# Altium schematic sheet MIXR Processing - STM32 DSP Misc.SchDoc: STM32F767 DSP Microcontroller - Clock & Power
size B; Organization: Midnight Sun Solar Rayce Car Team; Address1: University of Waterloo; Address2: 200 University Ave W; Address3: Waterloo, ON, Canada; Address4: N2L 3E9; DocumentNumber: 10; SheetNumber: 10; SheetTotal: 14; Website: www.uwmidsun.com; ProjectName: ProjectName
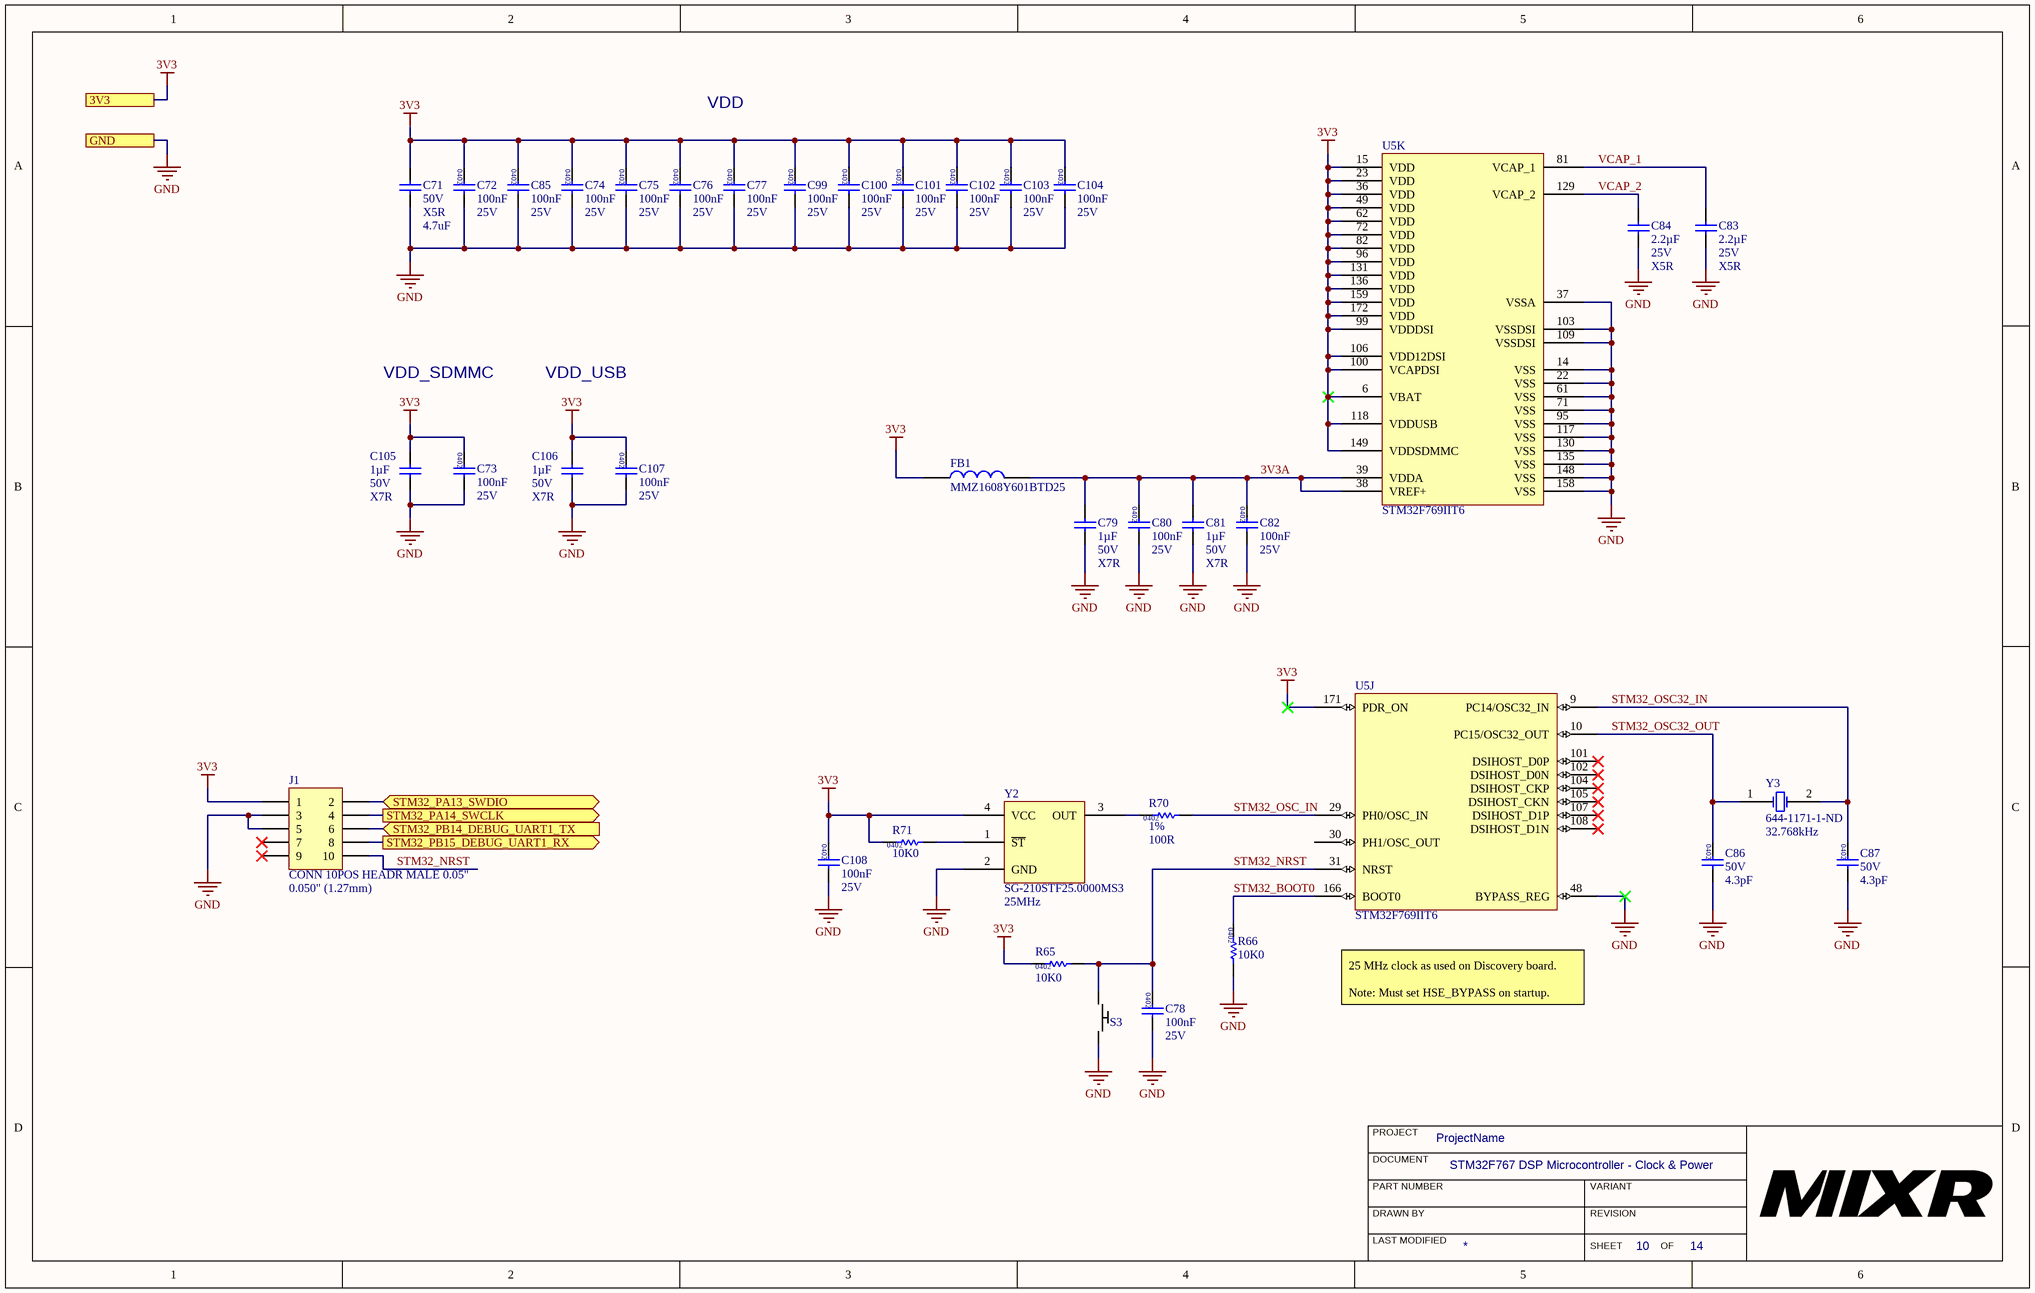
[diagram p0: MIXR Processing - STM32 DSP Misc.SchDoc]

## Parts
C71  value 4.7uF  Voltage - Rated: 50V  Temperature Coefficient: X5R  [CAP, 0805]  (hidden comment: CAP CER 4.7UF 50V 10% X5R 0805)
C72  Capacitance: 100nF  Voltage: 25V  [CAP 0402]  (hidden comment: CAP CER 0.1UF 16V X7R 0402)
C73  Capacitance: 100nF  Voltage: 25V  [CAP 0402]  (hidden comment: CAP CER 0.1UF 16V X7R 0402)
C74  Capacitance: 100nF  Voltage: 25V  [CAP 0402]  (hidden comment: CAP CER 0.1UF 16V X7R 0402)
C75  Capacitance: 100nF  Voltage: 25V  [CAP 0402]  (hidden comment: CAP CER 0.1UF 16V X7R 0402)
C76  Capacitance: 100nF  Voltage: 25V  [CAP 0402]  (hidden comment: CAP CER 0.1UF 16V X7R 0402)
C77  Capacitance: 100nF  Voltage: 25V  [CAP 0402]  (hidden comment: CAP CER 0.1UF 16V X7R 0402)
C78  Capacitance: 100nF  Voltage: 25V  [CAP 0402]  (hidden comment: CAP CER 0.1UF 16V X7R 0402)
C79  Capacitance: 1µF  Voltage: 50V  Temperature Coefficient: X7R  [CAP, 0603]  (hidden comment: CAP CER 1UF 50V 10% X7R 0603)
C80  Capacitance: 100nF  Voltage: 25V  [CAP 0402]  (hidden comment: CAP CER 0.1UF 16V X7R 0402)
C81  Capacitance: 1µF  Voltage: 50V  Temperature Coefficient: X7R  [CAP, 0603]  (hidden comment: CAP CER 1UF 50V 10% X7R 0603)
C82  Capacitance: 100nF  Voltage: 25V  [CAP 0402]  (hidden comment: CAP CER 0.1UF 16V X7R 0402)
C83  Capacitance: 2.2µF  Voltage: 25V  Temperature Coefficient: X5R  [CAP, 0603]  (hidden comment: CAP CER 2.2UF 25V 10% X5R 0603)
C84  Capacitance: 2.2µF  Voltage: 25V  Temperature Coefficient: X5R  [CAP, 0603]  (hidden comment: CAP CER 2.2UF 25V 10% X5R 0603)
C85  Capacitance: 100nF  Voltage: 25V  [CAP 0402]  (hidden comment: CAP CER 0.1UF 16V X7R 0402)
C86  Voltage Rating: 50V  Capacitance: 4.3pF  [CAP 0402]  (hidden comment: CAP CER 4.3PF 50V C0G/NPO 0402)
C87  Voltage Rating: 50V  Capacitance: 4.3pF  [CAP 0402]  (hidden comment: CAP CER 4.3PF 50V C0G/NPO 0402)
C99  Capacitance: 100nF  Voltage: 25V  [CAP 0402]  (hidden comment: CAP CER 0.1UF 16V X7R 0402)
C100  Capacitance: 100nF  Voltage: 25V  [CAP 0402]  (hidden comment: CAP CER 0.1UF 16V X7R 0402)
C101  Capacitance: 100nF  Voltage: 25V  [CAP 0402]  (hidden comment: CAP CER 0.1UF 16V X7R 0402)
C102  Capacitance: 100nF  Voltage: 25V  [CAP 0402]  (hidden comment: CAP CER 0.1UF 16V X7R 0402)
C103  Capacitance: 100nF  Voltage: 25V  [CAP 0402]  (hidden comment: CAP CER 0.1UF 16V X7R 0402)
C104  Capacitance: 100nF  Voltage: 25V  [CAP 0402]  (hidden comment: CAP CER 0.1UF 16V X7R 0402)
C105  Capacitance: 1µF  Voltage: 50V  Temperature Coefficient: X7R  [CAP, 0603]  (hidden comment: CAP CER 1UF 50V 10% X7R 0603)
C106  Capacitance: 1µF  Voltage: 50V  Temperature Coefficient: X7R  [CAP, 0603]  (hidden comment: CAP CER 1UF 50V 10% X7R 0603)
C107  Capacitance: 100nF  Voltage: 25V  [CAP 0402]  (hidden comment: CAP CER 0.1UF 16V X7R 0402)
C108  Capacitance: 100nF  Voltage: 25V  [CAP 0402]  (hidden comment: CAP CER 0.1UF 16V X7R 0402)
FB1  Manufacturer Part Number: MMZ1608Y601BTD25  [FB 0603]  (hidden comment: FB 600 OHM 1LN 0603)
J1  CONN 10POS HEADR MALE 0.05"  Pitch - Mating: 0.050" (1.27mm)  [CONN, 10POS 0.05" Debug Header]
R65  Resistance: 10K0  [RES 0402]  (hidden comment: RES 10K OHM 1% 1/16W 0402)
R66  Resistance: 10K0  [RES 0402]  (hidden comment: RES 10K OHM 1% 1/16W 0402)
R70  Tolerance: 1%  Resistance: 100R  [RES 0402]  (hidden comment: RES 100 OHM 1% 1/16W 0402)
R71  Resistance: 10K0  [RES 0402]  (hidden comment: RES 10K OHM 1% 1/16W 0402)
S3  SPST  [SW SPST-NO 0.05A 12V]  (value not drawn)
U5  Manufacturer Part Number: STM32F769IIT6  [TSQFP50P2600X2600X160-176M]  (hidden comment: IC MCU STM32F769II 176-LQFP)  (parts J,K of 11)
Y2  Manufacturer Part Number: SG-210STF25.0000MS3  Frequency: 25MHz  [CRYSTAL 25 MHz OSC XO CMOS SMD]  (hidden comment: CRYSTAL 25 MHz OSC XO CMOS SMD)
Y3  Supplier Part Number 1: 644-1171-1-ND  Frequency: 32.768kHz  [CRYSTAL 32.7680 KHZ 6PF 2-SMD]  (hidden comment: CRYSTAL 32.7680 KHZ 6PF 2-SMD)

## Ports
3V3, GND, STM32_PA13_SWDIO (bidir), STM32_PA14_SWCLK (out), STM32_PB14_DEBUG_UART1_TX (in), STM32_PB15_DEBUG_UART1_RX (out)

## Nets
3V3: C71.1 C72.1 C73.1 C74.1 C75.1 C76.1 C77.1 C85.1 C99.1 C100.1 C101.1 C102.1 C103.1 C104.1 C105.1 C106.1 C107.1 C108.1 FB1.1 J1.1 R65.1 R71.1 U5.6(VBAT) U5.15(VDD) U5.23(VDD) U5.36(VDD) U5.49(VDD) U5.62(VDD) U5.72(VDD) U5.82(VDD) U5.96(VDD) U5.99(VDDDSI) U5.100(VCAPDSI) U5.106(VDD12DSI) U5.118(VDDUSB) U5.131(VDD) U5.136(VDD) U5.149(VDDSDMMC) U5.159(VDD) U5.171(PDR_ON) U5.172(VDD) Y2.4(VCC) ; port 3V3
GND: C71.2 C72.2 C73.2 C74.2 C75.2 C76.2 C77.2 C78.2 C79.2 C80.2 C81.2 C82.2 C83.2 C84.2 C85.2 C86.2 C87.2 C99.2 C100.2 C101.2 C102.2 C103.2 C104.2 C105.2 C106.2 C107.2 C108.2 J1.3 J1.5 R66.2 S3.2 U5.14(VSS) U5.22(VSS) U5.37(VSSA) U5.48(BYPASS_REG) U5.61(VSS) U5.71(VSS) U5.95(VSS) U5.103(VSSDSI) U5.109(VSSDSI) U5.117(VSS) U5.130(VSS) U5.135(VSS) U5.148(VSS) U5.158(VSS) Y2.2(GND) ; port GND
3V3A: C79.1 C80.1 C81.1 C82.1 FB1.2 U5.38(VREF+) U5.39(VDDA)
STM32_BOOT0: R66.1 U5.166(BOOT0)
STM32_NRST: C78.1 J1.10 R65.2 S3.1 U5.31(NRST)
STM32_OSC32_IN: C87.1 U5.9(PC14/OSC32_IN) Y3.2
STM32_OSC32_OUT: C86.1 U5.10(PC15/OSC32_OUT) Y3.1
STM32_OSC_IN: R70.2 U5.29(PH0/OSC_IN)
STM32_PA13_SWDIO: J1.2 ; port STM32_PA13_SWDIO
STM32_PA14_SWCLK: J1.4 ; port STM32_PA14_SWCLK
STM32_PB14_DEBUG_UART1_TX: J1.6 ; port STM32_PB14_DEBUG_UART1_TX
STM32_PB15_DEBUG_UART1_RX: J1.8 ; port STM32_PB15_DEBUG_UART1_RX
VCAP_1: C83.1 U5.81(VCAP_1)
VCAP_2: C84.1 U5.129(VCAP_2)
NetR70_1: R70.1 Y2.3(OUT)
NetR71_2: R71.2 Y2.1(~{ST})

Not connected (* = marked no-connect by the designer): J1 7* 9*; U5 30(PH1/OSC_OUT) 101(DSIHOST_D0P)* 102(DSIHOST_D0N)* 104(DSIHOST_CKP)* 105(DSIHOST_CKN)* 107(DSIHOST_D1P)* 108(DSIHOST_D1N)*

## Notes on the sheet
- VDD
- VDD_SDMMC
- VDD_USB
- 25 MHz clock as used on Discovery board.
  Note: Must set HSE_BYPASS on startup.
- PROJECT
- DOCUMENT
- DRAWN BY
- LAST MODIFIED
- PART NUMBER
- REVISION
- SHEET
- VARIANT
- OF

## Library data of the parts
C71 = CAP CER 4.7UF 50V 10% X5R 0805: 4.7µF ±20% 50V Ceramic Capacitor X5R 0805 (2012 Metric); Manufacturer 1: Murata Electronics North America; Manufacturer Part Number 1: GRT21BR61H475ME13L; Description 1: CAP CER 4.7UF 50V X5R 0805; Supplier 1: Digi-Key; Supplier Part Number 1: 490-12395-1-ND; RoHS: RoHS Compliant; Category: Capacitors; Stock 1: 4286; Pricing 1: 1=0.56, 10=0.389, 100=0.2338, 500=0.17536, 1000=0.14808 (CAD); Packaging: Cut Tape (CT); Part Status: Active; Tolerance: ±20%; Operating Temperature: -55°C ~ 85°C; Features: -; Ratings: AEC-Q200; Applications: Automotive; Mounting Type: Surface Mount, MLCC; Package / Case: 0805 (2012 Metric); Size / Dimension: 0.079" L x 0.049" W (2.00mm x 1.25mm); Height - Seated (Max): -; Thickness (Max): 0.057" (1.45mm); Lead Spacing: -; Lead Style: -; ComponentLink1URL: http://search.murata.co.jp/Ceramy/image/img/A01X/G101/ENG/GRT21BR61H475ME13-01.pdf; ComponentLink1Description: http://search.murata.co.jp/Ceramy/image/img/A01X/G101/ENG/GRT21BR61H475ME13-01.pdf
C72-C78 C80 C82 C85 C99-C104 C107 C108 = CAP CER 0.1UF 16V X7R 0402: Cap Ceramic 0.1uF 25V X7R 10% SMD 0402 125C Paper T/R; Manufacturer: Murata; Manufacturer Part Number: GRM155R71E104KE14D; Supplier 1: Digi-Key; Supplier Part Number 1: 490-10698-1-ND; Packaging: Tape and Reel; ComponentLink1URL: http://www.farnell.com/datasheets/2048008.pdf?src-supplier=Farnell; ComponentLink1Description: http://www.farnell.com/datasheets/2048008.pdf?src-supplier=Farnell; Tolerance: 10%; RoHS: Yes; Category: Ceramic Capacitors; Stock 1: 785540; Pricing 1: 1=0.10000, 10=0.03400, 100=0.01520, 500=0.01088, 1000=0.00855, 2500=0.00778, 5000=0.00715 (USD); Mount: Surface Mount; Case/Package: 0402; Weight: 0.000212oz; Case Code (Metric): 1005; Case Code (Imperial): 0402; Dielectric Material: Ceramic; Min Operating Temperature: -55°C; Max Operating Temperature: 125°C; Termination: SMD/SMT; Composition: Ceramic; Package Quantity: 10000; Length: 1mm; Height: 0.5mm; Width: 0.02inch; Thickness: 0.022inch; Depth: 0.5mm; REACH SVHC: Unknown; Lead Free: Lead Free; ComponentLink2URL: http://uk.rs-online.com/webdocs/144c/0900766b8144c113.pdf?src-supplier=RSComponents; ComponentLink2Description: http://uk.rs-online.com/webdocs/144c/0900766b8144c113.pdf?src-supplier=RSComponents; ComponentLink3URL: http://www.farnell.com/datasheets/1872206.pdf?src-supplier=Farnell; ComponentLink3Description: http://www.farnell.com/datasheets/1872206.pdf?src-supplier=Farnell; ComponentLink4URL: http://components.arrow.com/part/dataview/0323_06361249?src-supplier=Arrow+Europe; ComponentLink4Description: http://components.arrow.com/part/dataview/0323_06361249?src-supplier=Arrow+Europe; ComponentLink5URL: http://www.mouser.com/ds/2/281/c02e-2905.pdf?src-supplier=Mouser; ComponentLink5Description: http://www.mouser.com/ds/2/281/c02e-2905.pdf?src-supplier=Mouser; ComponentLink6URL: http://www.farnell.com/datasheets/2048008.pdf?src-supplier=Newark; ComponentLink6Description: http://www.farnell.com/datasheets/2048008.pdf?src-supplier=Newark; ComponentLink7URL: http://psearch.en.murata.com/capacitor/product/GRM155R71E104KE14%23.pdf?src-supplier=Avnet; ComponentLink7Description: http://psearch.en.murata.com/capacitor/product/GRM155R71E104KE14%23.pdf?src-supplier=Avnet; ComponentLink8URL: https://search.murata.co.jp/Ceramy/image/img/A01X/G101/ENG/GRM155R71E104KE14-01.pdf?src-supplier=Digi-Key; ComponentLink8Description: https://search.murata.co.jp/Ceramy/image/img/A01X/G101/ENG/GRM155R71E104KE14-01.pdf?src-supplier=Digi-Key; ComponentLink9URL: http://www.farnell.com/datasheets/2048008.pdf?src-supplier=Element14; ComponentLink9Description: http://www.farnell.com/datasheets/2048008.pdf?src-supplier=Element14; Dielectric: X7R; Voltage Rating (DC): 25V; Voltage Rating: 25V
C79 C81 C105 C106 = CAP CER 1UF 50V 10% X7R 0603: 1µF ±10% 50V Ceramic Capacitor X7R 0603 (1608 Metric); Manufacturer 1: Taiyo Yuden; Manufacturer Part Number 1: UMK107AB7105KA-T; Supplier 1: Digi-Key; Supplier Part Number 1: 587-3247-1-ND; Packaging: Cut Tape (CT); Part Status: Active; Operating Temperature: -55°C ~ 125°C; Ratings: -; Mounting Type: Surface Mount, MLCC; Package / Case: 0603 (1608 Metric); Size / Dimension: 0.063" L x 0.031" W (1.60mm x 0.80mm); Height - Seated (Max): -; Thickness (Max): 0.037" (0.95mm); Lead Spacing: -; Lead Style: -; ComponentLink1URL: http://www.yuden.co.jp/productdata/catalog/en/mlcc_all_e.pdf; ComponentLink1Description: http://www.yuden.co.jp/productdata/catalog/en/mlcc_all_e.pdf; Tolerance: ±10%
C83 C84 = CAP CER 2.2UF 25V 10% X5R 0603: 2.2µF ±10% 25V Ceramic Capacitor X5R 0603 (1608 Metric); Manufacturer 1: Murata Electronics North America; Manufacturer Part Number 1: GRM188R61E225KA12D; Supplier 1: Digi-Key; Supplier Part Number 1: 490-10731-1-ND; Packaging: Cut Tape (CT); Part Status: Active; Operating Temperature: -55°C ~ 85°C; Ratings: -; Mounting Type: Surface Mount, MLCC; Package / Case: 0603 (1608 Metric); Size / Dimension: 0.063" L x 0.031" W (1.60mm x 0.80mm); Height - Seated (Max): -; Thickness (Max): 0.035" (0.90mm); Lead Spacing: -; Lead Style: -; ComponentLink1URL: http://www.murata.com/~/media/webrenewal/support/library/catalog/products/capacitor/mlcc/c02e.ashx; ComponentLink1Description: http://www.murata.com/~/media/webrenewal/support/library/catalog/products/capacitor/mlcc/c02e.ashx; Tolerance: ±10%
C86 C87 = CAP CER 4.3PF 50V C0G/NPO 0402: Multilayer Ceramic Capacitors MLCC - SMD/SMT 0402 4.3pF 50Volts C0G +/-0.1pF; Manufacturer: Murata; Manufacturer Part Number: GJM1555C1H4R3BB01D; Supplier 1: Digi-Key; RoHS: Yes; Category: Ceramic Capacitors; Stock 1: 18899; Pricing 1: 1=0.19000, 10=0.13000, 100=0.06590, 500=0.04508, 1000=0.03987, 2500=0.03814, 5000=0.03467 (USD); Mount: Surface Mount; Case/Package: 0402; Case Code (Metric): 1005; Case Code (Imperial): 0402; Min Operating Temperature: -55°C; Max Operating Temperature: 125°C; Package Quantity: 10000; Packaging: Tape and Reel; Dielectric: C0G; Voltage Rating (DC): 50V; Termination: SMD/SMT; Length: 1mm; Height: 0.5mm; Width: 0.02inch; Thickness: 0.022inch; Depth: 0.5mm; Radiation Hardening: No; ComponentLink1URL: https://datasheet.ciiva.com/11613/product-11613476.pdf?src-supplier=Avnet; ComponentLink1Description: https://datasheet.ciiva.com/11613/product-11613476.pdf?src-supplier=Avnet; ComponentLink2URL: https://datasheet.ciiva.com/29536/partnumbering-e-01-29536085.pdf?src-supplier=Digi-Key; ComponentLink2Description: https://datasheet.ciiva.com/29536/partnumbering-e-01-29536085.pdf?src-supplier=Digi-Key; ComponentLink3URL: https://datasheet.ciiva.com/29536/partnumbering-e-01-29536086.pdf?src-supplier=Digi-Key; ComponentLink3Description: https://datasheet.ciiva.com/29536/partnumbering-e-01-29536086.pdf?src-supplier=Digi-Key; Supplier Part Number 1: 490-8582-1-ND
FB1 = FB 600 OHM 1LN 0603: FERRITE BEAD 600 OHM 0603 1LN; Manufacturer: TDK; Number of Lines: 1; Max Current Rating: 500mA; DC Resistance (DCR): 400mR; Impedance: 600R; Tolerance: 25%; Test Frequency: 100MHz; Supplier 1: Digi-Key; Supplier Part Number 1: 445-172850-1-ND; RoHS: Yes; Stock 1: 19540; Pricing 1: 1 = 0.10000, 10 = 0.07600, 25 = 0.06840, 50 = 0.05000, 100 = 0.04330, 250 = 0.03416, 500 = 0.02884, 1000 = 0.02429 (USD); Mount: Surface Mount; Case/Package: 0603; Weight: 7.1E-05oz; Case Code (Metric): 1608; Case Code (Imperial): 0603; Min Operating Temperature: -55°C; Max Operating Temperature: 125°C; Package Quantity: 4000; Packaging: Tape and Reel; Termination: SMD/SMT; Max DC Current: 500mA; Length: 0.063inch; Height: 0.037inch; Width: 0.031inch; Ratings: AEC-Q200
J1 = CONN 10POS HEADR MALE 0.05": 10 Positions Header Connector 0.050" (1.27mm) Surface Mount Gold; Manufacturer 1: Amphenol FCI; Manufacturer Part Number 1: 20021121-00010C4LF; Style: Board to Board; Shrouding: Unshrouded; Number of Positions: 10; Number of Positions Loaded: All; Contact Length - Mating: 0.120" (3.05mm); Material Flammability Rating: UL94 V-0; Supplier 1: Digi-Key; Supplier Part Number 1: 609-3695-1-ND; Packaging: Cut Tape (CT); Part Status: Active; Connector Type: Header; Contact Type: Male Pin; Number of Rows: 2; Row Spacing - Mating: 0.050" (1.27mm); Mounting Type: Surface Mount; Termination: Solder; Fastening Type: -; Contact Length - Post: -; Overall Contact Length: -; Insulation Height: -; Contact Shape: Square; Contact Finish - Mating: Gold; Contact Finish Thickness - Mating: 10µin (0.25µm); Contact Finish - Post: Tin; Contact Material: Copper Alloy; Insulation Material: Thermoplastic; Operating Temperature: -; Ingress Protection: -; Insulation Color: Black; Current Rating: -; Mated Stacking Heights: -; Contact Finish Thickness - Post: 50µin (1.27µm); ComponentLink1URL: http://portal.fciconnect.com/Comergent//fci/drawing/20021121.pdf; ComponentLink1Description: http://portal.fciconnect.com/Comergent//fci/drawing/20021121.pdf; Voltage: -
R65 R66 R71 = RES 10K OHM 1% 1/16W 0402: Surface Mount Thick Film Resistor, Rc Series, 10 Kohm, 62.5 Mw, - 1%, 50 V, 0402 [1005 Metric]; Manufacturer: Yageo; Manufacturer Part Number: RC0402FR-0710KL; Temperature Coefficient: 100ppm/°C; Voltage Rating: 50V; Power Rating: 62.5mW; Supplier 1: Digi-Key; Supplier Part Number 1: 311-10.0KLRCT-ND; Packaging: Tape and Reel; Composition: Thick Film; ComponentLink1URL: https://datasheet.ciiva.com/7660/38568-7660787.pdf?src-supplier=Element14; ComponentLink1Description: https://datasheet.ciiva.com/7660/38568-7660787.pdf?src-supplier=Element14; Tolerance: 1%; RoHS: Yes; Category: Chip SMD Resistors; Stock 1: 60761136; Pricing 1: 1=0.10000, 10=0.01600, 100=0.00640, 1000=0.00289, 2500=0.00251, 5000=0.00207 (USD); Case/Package: 0402; Number of Pins: 2; Case Code (Imperial): 0402; Case Code (Metric): 1005; Min Operating Temperature: -55°C; Max Operating Temperature: 155°C; Voltage Rating (DC): 50V; Termination: SMD/SMT; Military Standard: Not; Working Voltage: 50V; Number of Terminations: 2; Length: 1mm; Height: 0.32mm; Width: 0.5mm; Depth: 0.5mm; Lead Pitch: 0.2mm; REACH SVHC: No SVHC; Lead Free: Lead Free; ComponentLink2URL: https://datasheet.ciiva.com/7983/1018594-7983486.pdf?src-supplier=Element14; ComponentLink2Description: https://datasheet.ciiva.com/7983/1018594-7983486.pdf?src-supplier=Element14; ComponentLink3URL: https://datasheet.ciiva.com/7849/1784430-7849813.pdf?src-supplier=Element14; ComponentLink3Description: https://datasheet.ciiva.com/7849/1784430-7849813.pdf?src-supplier=Element14; ComponentLink4URL: https://datasheet.ciiva.com/7849/1686128-7849814.pdf?src-supplier=Element14; ComponentLink4Description: https://datasheet.ciiva.com/7849/1686128-7849814.pdf?src-supplier=Element14; ComponentLink5URL: https://datasheet.ciiva.com/7849/1784430-7849815.pdf?src-supplier=Element14; ComponentLink5Description: https://datasheet.ciiva.com/7849/1784430-7849815.pdf?src-supplier=Element14; ComponentLink6URL: https://datasheet.ciiva.com/22747/1018594-22747512.pdf?src-supplier=Element14; ComponentLink6Description: https://datasheet.ciiva.com/22747/1018594-22747512.pdf?src-supplier=Element14; ComponentLink7URL: https://datasheet.ciiva.com/12667/pyu-rc0402-51-rohs-l-6-r-12667067.pdf?src-supplier=Mouser; ComponentLink7Description: https://datasheet.ciiva.com/12667/pyu-rc0402-51-rohs-l-6-r-12667067.pdf?src-supplier=Mouser
R70 = RES 100 OHM 1% 1/16W 0402: 100 Ohms ±1% 0.063W, 1/16W Chip Resistor 0402 (1005 Metric) Moisture Resistant Thick Film; Manufacturer: Yageo; Manufacturer Part Number: RC0402FR-07100RL; Power Rating: 62.5mW; Voltage Rating: 50V; Temperature Coefficient: 100ppm/°C; Supplier 1: Digi-Key; RoHS: Yes; Category: Chip SMD Resistors; Stock 1: 42351567; Pricing 1: 1=0.10000, 10=0.01600, 100=0.00640, 1000=0.00289, 2500=0.00251, 5000=0.00207 (USD); Case/Package: 0402; Number of Pins: 2; Case Code (Imperial): 0402; Case Code (Metric): 1005; Min Operating Temperature: -55°C; Max Operating Temperature: 155°C; Packaging: Tape and Reel; Termination: SMD/SMT; Composition: Thick Film; Military Standard: Not; Voltage Rating (DC): 50V; Length: 1mm; Height: 0.32mm; Depth: 0.5mm; Width: 0.5mm; REACH SVHC: No SVHC; Lead Free: Lead Free; ComponentLink1URL: https://datasheet.ciiva.com/7849/1784430-7849810.pdf?src-supplier=Element14; ComponentLink1Description: https://datasheet.ciiva.com/7849/1784430-7849810.pdf?src-supplier=Element14; ComponentLink2URL: https://datasheet.ciiva.com/11808/0900766b80c66297-11808765.pdf?src-supplier=RSComponents; ComponentLink2Description: https://datasheet.ciiva.com/11808/0900766b80c66297-11808765.pdf?src-supplier=RSComponents; ComponentLink3URL: https://datasheet.ciiva.com/22747/1018594-22747511.pdf?src-supplier=Element14; ComponentLink3Description: https://datasheet.ciiva.com/22747/1018594-22747511.pdf?src-supplier=Element14; ComponentLink4URL: https://datasheet.ciiva.com/12667/pyu-rc0402-51-rohs-l-6-r-12667957.pdf?src-supplier=Mouser; ComponentLink4Description: https://datasheet.ciiva.com/12667/pyu-rc0402-51-rohs-l-6-r-12667957.pdf?src-supplier=Mouser; ComponentLink5URL: https://datasheet.ciiva.com/16740/pyu-rc0402-51-rohs-l-6-r-16740566.pdf?src-supplier=Future+Electronics; ComponentLink5Description: https://datasheet.ciiva.com/16740/pyu-rc0402-51-rohs-l-6-r-16740566.pdf?src-supplier=Future+Electronics; ComponentLink6URL: https://datasheet.ciiva.com/15189/getdatasheetpartid-329466-15189335.pdf?src-supplier=Verical; ComponentLink6Description: https://datasheet.ciiva.com/15189/getdatasheetpartid-329466-15189335.pdf?src-supplier=Verical; ComponentLink7URL: https://datasheet.ciiva.com/28367/1018594-28367226.pdf?src-supplier=Element14; ComponentLink7Description: https://datasheet.ciiva.com/28367/1018594-28367226.pdf?src-supplier=Element14; Supplier Part Number 1: 311-100LRCT-ND
S3 = SW SPST-NO 0.05A 12V: SWITCH TACTILE SPST-NO 50MA 12V; Manufacturer: E-Switch; Manufacturer Part Number: TL3305AF260QG; Mechanical Life: 200000Cycles; Illumination Type: Non-Illuminated; Operating Force: 260gf; Switch Travel: 0.2mm; Switch Function: Off-Mom; Actuator Type: Standard; Supplier 1: Digi-Key; RoHS: Yes; Category: Tactile Switches; Stock 1: 10795; Pricing 1: 1=0.20000, 10=0.19500, 25=0.18800, 50=0.18120, 100=0.17110, 250=0.16104, 500=0.15434, 1000=0.11743 (USD); Mount: Surface Mount; Min Operating Temperature: -20°C; Max Operating Temperature: 70°C; Packaging: Tape and Reel; Termination: Gull Wing; Throw Configuration: SPST; Lead Free: Lead Free; ComponentLink1URL: http://www.farnell.com/datasheets/2554191.pdf?src-supplier=Farnell; ComponentLink1Description: http://www.farnell.com/datasheets/2554191.pdf?src-supplier=Farnell; ComponentLink2URL: http://spec_sheets.e-switch.com/specs/P010471.pdf?src-supplier=Newark; ComponentLink2Description: http://spec_sheets.e-switch.com/specs/P010471.pdf?src-supplier=Newark; ComponentLink3URL: http://spec_sheets.e-switch.com/specs/P010471.pdf?src-supplier=Future+Electronics; ComponentLink3Description: http://spec_sheets.e-switch.com/specs/P010471.pdf?src-supplier=Future+Electronics; ComponentLink4URL: http://spec_sheets.e-switch.com/specs/P010471.pdf?src-supplier=Digi-Key; ComponentLink4Description: http://spec_sheets.e-switch.com/specs/P010471.pdf?src-supplier=Digi-Key; ComponentLink5URL: http://spec_sheets.e-switch.com/specs/P010471.pdf?src-supplier=Mouser; ComponentLink5Description: http://spec_sheets.e-switch.com/specs/P010471.pdf?src-supplier=Mouser; ComponentLink6URL: http://spec_sheets.e-switch.com/specs/P010471.pdf?src-supplier=NAC+Semi; ComponentLink6Description: http://spec_sheets.e-switch.com/specs/P010471.pdf?src-supplier=NAC+Semi; Supplier Part Number 1: EG5353CT-ND
U5 = IC MCU STM32F769II 176-LQFP: ARM® Cortex®-M7 STM32F7 Microcontroller IC 32-Bit 216MHz 2MB (2M x 8) FLASH 176-LQFP (24x24); Manufacturer: STMicroelectronics; Supplier 1: Digi-Key; RoHS: No; Category: Microcontrollers; Stock 1: 295; Pricing 1: 1=12.69000, 10=11.66300, 25=11.18000, 100=9.85040, 250=9.36696, 500=8.76264, 1000=8.03746 (USD); ComponentLink1URL: http://www.st.com/content/ccc/resource/technical/document/errata_sheet/group0/23/a6/11/0b/30/24/46/a5/DM00257543/files/DM00257543.pdf/jcr:content/translations/en.DM00257543.pdf?src-supplier=Digi-Key; ComponentLink1Description: http://www.st.com/content/ccc/resource/technical/document/errata_sheet/group0/23/a6/11/0b/30/24/46/a5/DM00257543/files/DM00257543.pdf/jcr:content/translations/en.DM00257543.pdf?src-supplier=Digi-Key; Supplier Part Number 1: 497-16649-ND
Y2 = CRYSTAL 25 MHz OSC XO CMOS SMD: XTAL OSC XO 25.0000MHZ CMOS SMD; Manufacturer: Epson; Max Supply Current: 2.2mA; Frequency Stability: 25ppm; Load Capacitance: 15pF; Min Supply Voltage: 1.6V; Max Supply Voltage: 3.6V; Max Duty Cycle: 55%; Supplier 1: Digi-Key; RoHS: Yes; Category: Oscillators; Stock 1: 1693; Pricing 1: 1=1.21000, 10=1.15900, 50=1.13200, 100=0.97020 (USD); Mount: Surface Mount; Case/Package: SMD/SMT; Min Operating Temperature: -20°C; Max Operating Temperature: 70°C; Package Quantity: 250; Packaging: Tape and Reel; Termination: SMD/SMT; Current Rating: 2.2mA; Length: 0.098inch; Height: 0.035inch; Width: 0.079inch; Lead Free: Lead Free; ComponentLink1URL: https://datasheet.ciiva.com/29629/029-sg-210stf-e147-29629845.pdf?src-supplier=Digi-Key; ComponentLink1Description: https://datasheet.ciiva.com/29629/029-sg-210stf-e147-29629845.pdf?src-supplier=Digi-Key; ComponentLink2URL: https://datasheet.ciiva.com/29629/029-sg-210stf-e147-29629799.pdf?src-supplier=Digi-Key; ComponentLink2Description: https://datasheet.ciiva.com/29629/029-sg-210stf-e147-29629799.pdf?src-supplier=Digi-Key; ComponentLink3URL: https://datasheet.ciiva.com/29629/029-sg-210stf-e147-29629798.pdf?src-supplier=Digi-Key; ComponentLink3Description: https://datasheet.ciiva.com/29629/029-sg-210stf-e147-29629798.pdf?src-supplier=Digi-Key; Supplier Part Number 1: SER3804CT-ND
Y3 = CRYSTAL 32.7680 KHZ 6PF 2-SMD: Crystal 32.7680KHZ 6PF SMD; Manufacturer: NDK; Manufacturer Part Number: NX3215SA-32.768K-STD-MUA-14; Frequency Tolerance: 20ppm; ESR (Equivalent Series Resistance): 70kR; Supplier 1: Digi-Key; RoHS: Yes; Category: Crystals; Stock 1: 61958; Pricing 1: 1=0.68000, 10=0.60200, 50=0.56280, 100=0.49740, 500=0.47124, 1000=0.39270 (USD); Mount: Surface Mount; Case/Package: SMD/SMT; Number of Pins: 2; Min Operating Temperature: -40°C; Max Operating Temperature: 85°C; Packaging: Tape and Reel; Package Quantity: 3000; Length: 0.126inch; Height: 0.035inch; Width: 0.059inch; ComponentLink1URL: https://datasheet.ciiva.com/6733/c-nx3215sa-std-mua-9-e-6733110.pdf?src-supplier=Digi-Key; ComponentLink1Description: https://datasheet.ciiva.com/6733/c-nx3215sa-std-mua-9-e-6733110.pdf?src-supplier=Digi-Key; ComponentLink2URL: https://datasheet.ciiva.com/6733/c-nx3215sa-std-mua-9-e-6733111.pdf?src-supplier=Digi-Key; ComponentLink2Description: https://datasheet.ciiva.com/6733/c-nx3215sa-std-mua-9-e-6733111.pdf?src-supplier=Digi-Key; ComponentLink3URL: https://datasheet.ciiva.com/6733/c-nx3215sa-std-mua-9-e-6733112.pdf?src-supplier=Digi-Key; ComponentLink3Description: https://datasheet.ciiva.com/6733/c-nx3215sa-std-mua-9-e-6733112.pdf?src-supplier=Digi-Key; Load Capacitance: 6pF